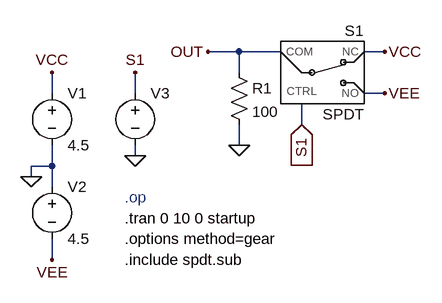
[diagram p0: schematic SPDT TB.asc]
SPDT TB.asc, the LTspice schematic file:
Version 4.1
SHEET 1 1528 980
WIRE -288 -320 -336 -320
WIRE -224 -320 -288 -320
WIRE -64 -320 -96 -320
WIRE -288 -288 -288 -320
WIRE -576 -256 -576 -288
WIRE -448 -256 -448 -288
WIRE -64 -256 -96 -256
WIRE -192 -208 -192 -240
WIRE -288 -176 -288 -208
WIRE -448 -160 -448 -176
WIRE -576 -144 -576 -176
WIRE -576 -144 -608 -144
WIRE -608 -128 -608 -144
WIRE -576 -112 -576 -144
WIRE -576 0 -576 -32
FLAG -576 -288 VCC
FLAG -576 0 VEE
FLAG -608 -128 0
FLAG -448 -160 0
FLAG -448 -288 S1
FLAG -192 -208 S1
IOPIN -192 -208 In
FLAG -64 -320 VCC
FLAG -64 -256 VEE
FLAG -336 -320 OUT
FLAG -288 -176 0
SYMBOL voltage -576 -272 R0
WINDOW 123 0 0 Left 0
WINDOW 39 0 0 Left 0
SYMATTR InstName V1
SYMATTR Value 4.5
SYMBOL voltage -576 -128 R0
WINDOW 123 0 0 Left 0
WINDOW 39 0 0 Left 0
SYMATTR InstName V2
SYMATTR Value 4.5
SYMBOL voltage -448 -272 R0
WINDOW 123 0 0 Left 0
WINDOW 39 0 0 Left 0
WINDOW 3 24 44 Invisible 2
SYMATTR Value PWL(0 0 1 0 2 1 3 1 4 0 5 0 5.001 0.5 6 0.5 6.001 1)
SYMATTR InstName V3
SYMBOL spdt -192 -288 M0
SYMATTR InstName S1
SYMBOL res -304 -304 R0
SYMATTR InstName R1
SYMATTR Value 100
TEXT -464 -64 Left 2 !.tran 0 10 0 startup
TEXT -464 -96 Left 2 ;.op
TEXT -464 -32 Left 2 !.options method=gear
TEXT -464 0 Left 2 !.include spdt.sub

The netlist it stands for:
* SPDT TB.asc
V1 VCC 0 4.5
V2 0 VEE 4.5
V3 S1 0 PWL(0 0 1 0 2 1 3 1 4 0 5 0 5.001 0.5 6 0.5 6.001 1)
X§S1 OUT VEE VCC S1 SPDT  ; pins COM NO NC CTRL
R1 OUT 0 100
.tran 0 10 0 startup
* .op
.options method=gear
.include spdt.sub
.backanno
.end